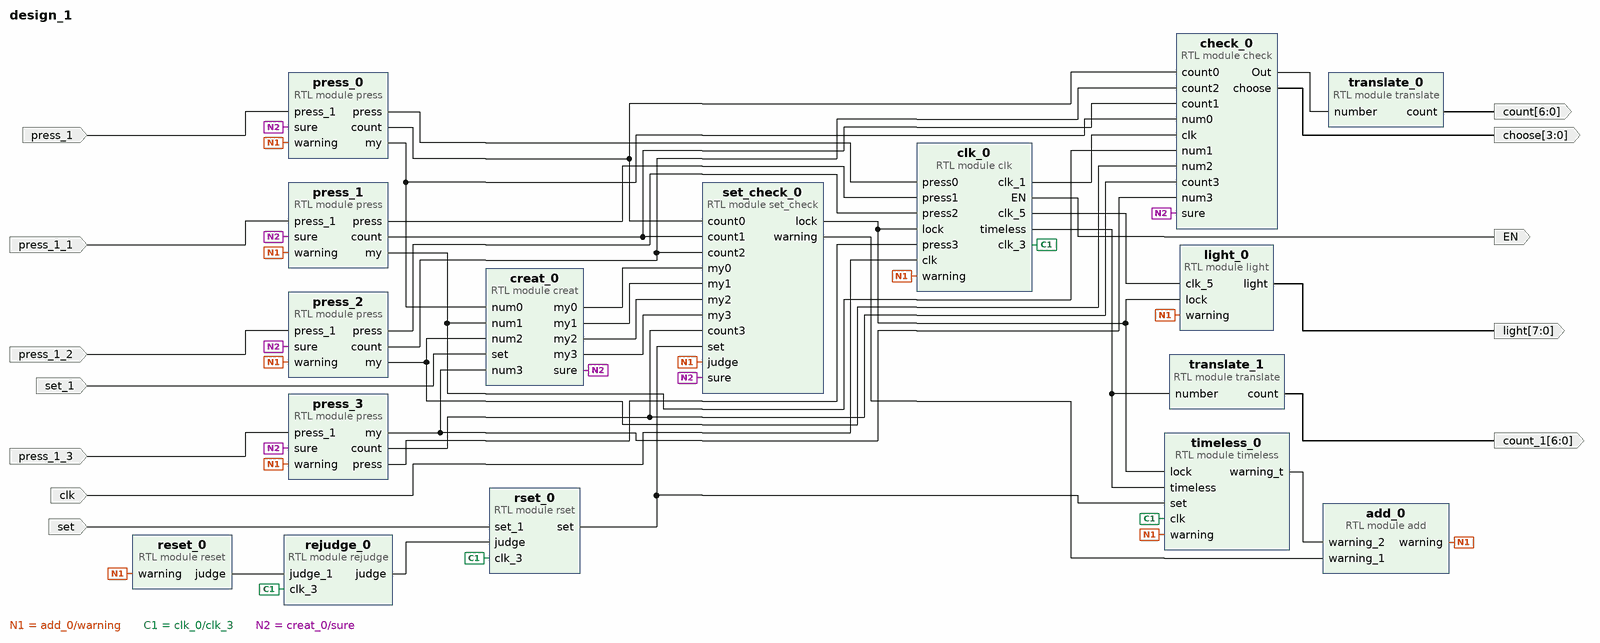
[diagram p0: block diagram of the top level]
# Vivado block design design_1, xc7a35tcsg324-3, Vivado 2017.1
create_bd_design design_1

create_bd_port -dir I press_1
create_bd_port -dir I press_1_1
create_bd_port -dir I press_1_2
create_bd_port -dir I press_1_3
create_bd_port -dir O -from 7 -to 0 light
create_bd_port -dir O EN
create_bd_port -dir O -from 3 -to 0 choose
create_bd_port -dir O -from 6 -to 0 count_1
create_bd_port -dir O -from 6 -to 0 count
create_bd_port -dir I -type clk clk
set_property -dict {CONFIG.FREQ_HZ 100000000} [get_bd_ports clk]
create_bd_port -dir I set
create_bd_port -dir I set_1

create_bd_cell -type module -reference translate translate_0
create_bd_cell -type module -reference translate translate_1
create_bd_cell -type module -reference rejudge rejudge_0
create_bd_cell -type module -reference check check_0
create_bd_cell -type module -reference rset rset_0
create_bd_cell -type module -reference light light_0
create_bd_cell -type module -reference creat creat_0
create_bd_cell -type module -reference add add_0
create_bd_cell -type module -reference timeless timeless_0
create_bd_cell -type module -reference set_check set_check_0
create_bd_cell -type module -reference clk clk_0
create_bd_cell -type module -reference press press_0
create_bd_cell -type module -reference press press_1
create_bd_cell -type module -reference press press_2
create_bd_cell -type module -reference press press_3
create_bd_cell -type module -reference reset reset_0

# ---- connections ----

connect_bd_net -net press_1_1 [get_bd_ports press_1] [get_bd_pins press_0/press_1]
connect_bd_net -net press_1_1_1 [get_bd_ports press_1_1] [get_bd_pins press_1/press_1]
connect_bd_net -net press_1_2_1 [get_bd_ports press_1_2] [get_bd_pins press_2/press_1]
connect_bd_net -net press_1_3_1 [get_bd_ports press_1_3] [get_bd_pins press_3/press_1]
connect_bd_net [get_bd_pins set_check_0/lock] [get_bd_pins light_0/lock] [get_bd_pins timeless_0/lock] [get_bd_pins clk_0/lock]
connect_bd_net [get_bd_pins light_0/light] [get_bd_ports light]
connect_bd_net [get_bd_pins clk_0/timeless] [get_bd_pins translate_1/number] [get_bd_pins timeless_0/timeless]
connect_bd_net [get_bd_pins press_1/press] [get_bd_pins clk_0/press1]
connect_bd_net [get_bd_pins press_2/press] [get_bd_pins clk_0/press2]
connect_bd_net [get_bd_pins press_3/press] [get_bd_pins clk_0/press3]
connect_bd_net [get_bd_pins press_0/count] [get_bd_pins check_0/count0] [get_bd_pins set_check_0/count0]
connect_bd_net [get_bd_pins press_2/count] [get_bd_pins check_0/count2] [get_bd_pins set_check_0/count2]
connect_bd_net [get_bd_pins clk_0/EN] [get_bd_ports EN]
connect_bd_net [get_bd_pins check_0/Out] [get_bd_pins translate_0/number]
connect_bd_net [get_bd_pins check_0/choose] [get_bd_ports choose]
connect_bd_net [get_bd_pins translate_1/count] [get_bd_ports count_1]
connect_bd_net [get_bd_pins translate_0/count] [get_bd_ports count]
connect_bd_net [get_bd_ports clk] [get_bd_pins clk_0/clk]
connect_bd_net [get_bd_pins press_1/count] [get_bd_pins check_0/count1] [get_bd_pins set_check_0/count1]
connect_bd_net [get_bd_pins timeless_0/warning_t] [get_bd_pins add_0/warning_2]
connect_bd_net [get_bd_pins add_0/warning] \
  [get_bd_pins light_0/warning] [get_bd_pins timeless_0/warning] [get_bd_pins set_check_0/judge] [get_bd_pins clk_0/warning] \
  [get_bd_pins press_0/warning] [get_bd_pins press_1/warning] [get_bd_pins press_2/warning] [get_bd_pins press_3/warning] \
  [get_bd_pins reset_0/warning]
connect_bd_net [get_bd_pins clk_0/clk_1] [get_bd_pins check_0/clk]
connect_bd_net [get_bd_pins clk_0/clk_3] [get_bd_pins rejudge_0/clk_3] [get_bd_pins rset_0/clk_3] [get_bd_pins timeless_0/clk]
connect_bd_net [get_bd_pins reset_0/judge] [get_bd_pins rejudge_0/judge_1]
connect_bd_net [get_bd_pins rejudge_0/judge] [get_bd_pins rset_0/judge]
connect_bd_net [get_bd_ports set] [get_bd_pins rset_0/set_1]
connect_bd_net [get_bd_pins rset_0/set] [get_bd_pins timeless_0/set] [get_bd_pins set_check_0/set]
connect_bd_net [get_bd_pins clk_0/clk_5] [get_bd_pins light_0/clk_5]
connect_bd_net -net set_1_1 [get_bd_ports set_1] [get_bd_pins creat_0/set]
connect_bd_net [get_bd_pins press_0/my] [get_bd_pins check_0/num0] [get_bd_pins creat_0/num0]
connect_bd_net [get_bd_pins press_0/press] [get_bd_pins clk_0/press0]
connect_bd_net [get_bd_pins press_1/my] [get_bd_pins check_0/num1] [get_bd_pins creat_0/num1]
connect_bd_net [get_bd_pins press_2/my] [get_bd_pins check_0/num2] [get_bd_pins creat_0/num2]
connect_bd_net [get_bd_pins press_3/count] [get_bd_pins check_0/count3] [get_bd_pins set_check_0/count3]
connect_bd_net [get_bd_pins creat_0/sure] \
  [get_bd_pins check_0/sure] [get_bd_pins set_check_0/sure] [get_bd_pins press_0/sure] [get_bd_pins press_1/sure] \
  [get_bd_pins press_2/sure] [get_bd_pins press_3/sure]
connect_bd_net [get_bd_pins creat_0/my0] [get_bd_pins set_check_0/my0]
connect_bd_net [get_bd_pins creat_0/my1] [get_bd_pins set_check_0/my1]
connect_bd_net [get_bd_pins creat_0/my2] [get_bd_pins set_check_0/my2]
connect_bd_net [get_bd_pins creat_0/my3] [get_bd_pins set_check_0/my3]
connect_bd_net [get_bd_pins press_3/my] [get_bd_pins check_0/num3] [get_bd_pins creat_0/num3]
connect_bd_net [get_bd_pins set_check_0/warning] [get_bd_pins add_0/warning_1]

validate_bd_design
save_bd_design
